# Altium schematic sheet Mezzanine Connectors.SchDoc
size A4; SheetNumber: 11; SheetTotal: 11
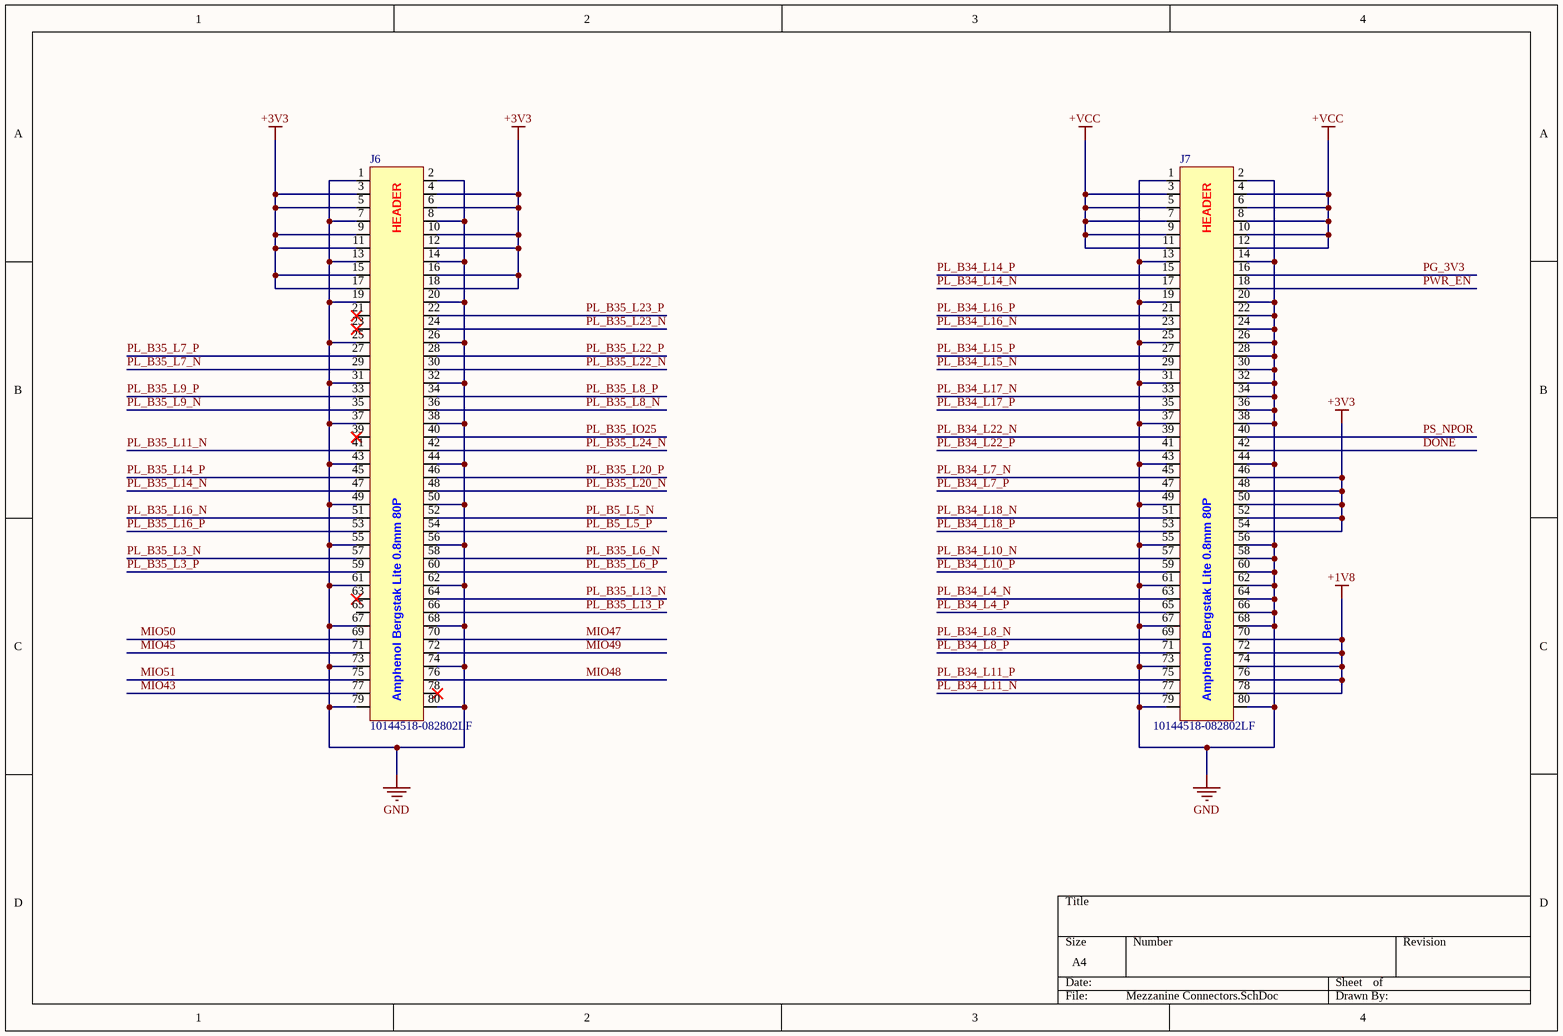
[diagram p0: Mezzanine Connectors.SchDoc]

## Parts
J6  10144518-082802LF  [10144518-082802LF]
J7  10144518-082802LF  [10144518-082802LF]

## Nets
+1V8: J7.70 J7.72 J7.74 J7.76 J7.78
+3V3: J6.3 J6.4 J6.5 J6.6 J6.9 J6.10 J6.11 J6.12 J6.15 J6.16 J6.17 J6.18 J7.46 J7.48 J7.50 J7.52 J7.54
+VCC: J7.3 J7.4 J7.5 J7.6 J7.7 J7.8 J7.9 J7.10 J7.11 J7.12
GND: J6.1 J6.2 J6.7 J6.8 J6.13 J6.14 J6.19 J6.20 J6.25 J6.26 J6.31 J6.32 J6.37 J6.38 J6.43 J6.44 J6.49 J6.50 J6.55 J6.56 J6.61 J6.62 J6.67 J6.68 J6.73 J6.74 J6.79 J6.80 J7.1 J7.2 J7.13 J7.14 J7.19 J7.20 J7.22 J7.24 J7.25 J7.26 J7.28 J7.30 J7.31 J7.32 J7.34 J7.36 J7.37 J7.38 J7.43 J7.44 J7.49 J7.55 J7.56 J7.58 J7.60 J7.61 J7.62 J7.64 J7.66 J7.67 J7.68 J7.73 J7.79 J7.80
DONE: J7.42
MIO43: J6.77
MIO45: J6.71
MIO47: J6.70
MIO48: J6.76
MIO49: J6.72
MIO50: J6.69
MIO51: J6.75
PG_3V3: J7.16
PL_B5_L5_N: J6.52
PL_B5_L5_P: J6.54
PL_B34_L4_N: J7.63
PL_B34_L4_P: J7.65
PL_B34_L7_N: J7.45
PL_B34_L7_P: J7.47
PL_B34_L8_N: J7.69
PL_B34_L8_P: J7.71
PL_B34_L10_N: J7.57
PL_B34_L10_P: J7.59
PL_B34_L11_N: J7.77
PL_B34_L11_P: J7.75
PL_B34_L14_N: J7.17
PL_B34_L14_P: J7.15
PL_B34_L15_N: J7.29
PL_B34_L15_P: J7.27
PL_B34_L16_N: J7.23
PL_B34_L16_P: J7.21
PL_B34_L17_N: J7.33
PL_B34_L17_P: J7.35
PL_B34_L18_N: J7.51
PL_B34_L18_P: J7.53
PL_B34_L22_N: J7.39
PL_B34_L22_P: J7.41
PL_B35_IO25: J6.40
PL_B35_L3_N: J6.57
PL_B35_L3_P: J6.59
PL_B35_L6_N: J6.58
PL_B35_L6_P: J6.60
PL_B35_L7_N: J6.29
PL_B35_L7_P: J6.27
PL_B35_L8_N: J6.36
PL_B35_L8_P: J6.34
PL_B35_L9_N: J6.35
PL_B35_L9_P: J6.33
PL_B35_L11_N: J6.41
PL_B35_L13_N: J6.64
PL_B35_L13_P: J6.66
PL_B35_L14_N: J6.47
PL_B35_L14_P: J6.45
PL_B35_L16_N: J6.51
PL_B35_L16_P: J6.53
PL_B35_L20_N: J6.48
PL_B35_L20_P: J6.46
PL_B35_L22_N: J6.30
PL_B35_L22_P: J6.28
PL_B35_L23_N: J6.24
PL_B35_L23_P: J6.22
PL_B35_L24_N: J6.42
PS_NPOR: J7.40
PWR_EN: J7.18

Not connected (* = marked no-connect by the designer): J6 21* 23* 39* 63* 65 78*

## Notes on the sheet
- (in symbol 10144518-082802LF) HEADER; Amphenol Bergstak Lite 0.8mm 80P

## Library data of the parts
J6 J7 = 10144518-082802LF: BergStak® Lite 0.80mm, Board-to-Board Connector, 80 Positions, Dual Row, Vertical Header; Manufacturer: Amphenol; Manufacturer Part Number: 10144518-082802LF